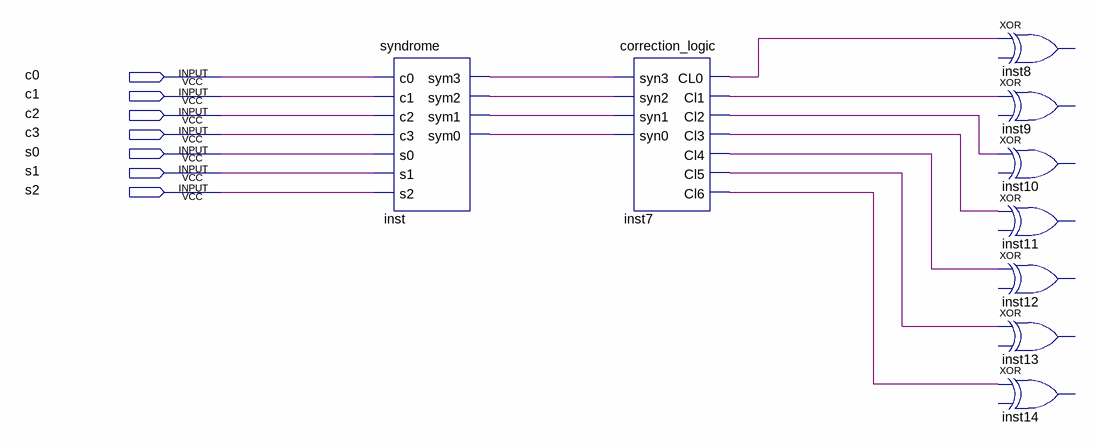
[diagram p0: schematic sheet]
// Quartus schematic corrected_codeword.bdf as structural Verilog: 9 symbols, 7 pins
module corrected_codeword (
  input  c0,
  input  c1,
  input  c2,
  input  c3,
  input  s0,
  input  s1,
  input  s2
);

  wire inst7_cl0, inst7_cl1, inst7_cl2, inst7_cl3, inst7_cl4, inst7_cl5, inst7_cl6, inst_sym0, inst_sym1,
       inst_sym2, inst_sym3;

  syndrome inst (
    .c0(c0), .c1(c1), .c2(c2), .c3(c3), .s0(s0), .s1(s1), .s2(s2), .sym3(inst_sym3), .sym2(inst_sym2),
    .sym1(inst_sym1), .sym0(inst_sym0));
  correction_logic inst7 (
    .syn3(inst_sym3), .syn2(inst_sym2), .syn1(inst_sym1), .syn0(inst_sym0), .CL0(inst7_cl0), .Cl1(inst7_cl1),
    .Cl2(inst7_cl2), .Cl3(inst7_cl3), .Cl4(inst7_cl4), .Cl5(inst7_cl5), .Cl6(inst7_cl6));
  // XOR inst8 has open pins: IN1=inst7_cl0, IN2=open, OUT=open
  // XOR inst9 has open pins: IN1=inst7_cl1, IN2=open, OUT=open
  // XOR inst10 has open pins: IN1=inst7_cl2, IN2=open, OUT=open
  // XOR inst11 has open pins: IN1=inst7_cl3, IN2=open, OUT=open
  // XOR inst12 has open pins: IN1=inst7_cl4, IN2=open, OUT=open
  // XOR inst13 has open pins: IN1=inst7_cl5, IN2=open, OUT=open
  // XOR inst14 has open pins: IN1=inst7_cl6, IN2=open, OUT=open
endmodule
